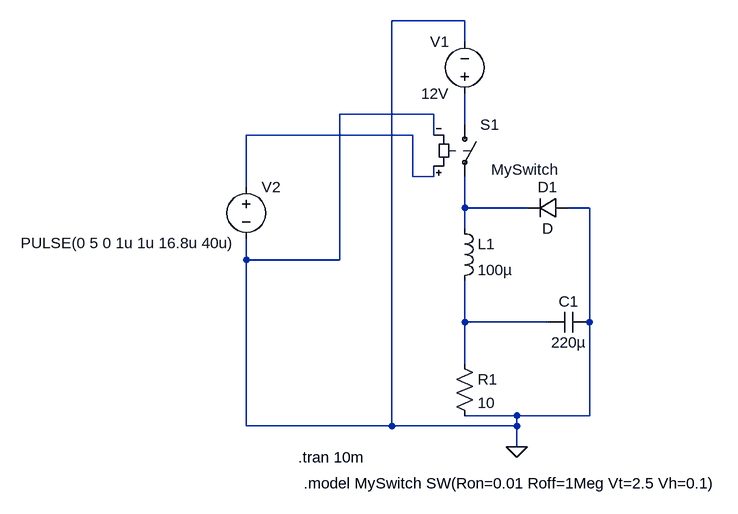
[diagram p0: schematic Buck_Converter.asc]
Buck_Converter.asc, the LTspice schematic file:
Version 4.1
SHEET 1 1072 744
WIRE 112 16 0 16
WIRE 112 48 112 16
WIRE 64 160 -80 160
WIRE 112 176 112 128
WIRE 32 192 -224 192
WIRE 64 192 64 160
WIRE 32 256 32 192
WIRE 64 256 64 240
WIRE 64 256 32 256
WIRE -224 272 -224 192
WIRE 112 304 112 256
WIRE 208 304 112 304
WIRE 304 304 272 304
WIRE 112 336 112 304
WIRE -224 384 -224 352
WIRE -80 384 -80 160
WIRE -80 384 -224 384
WIRE 112 480 112 416
WIRE 240 480 112 480
WIRE 304 480 304 304
WIRE 112 544 112 480
WIRE 192 624 112 624
WIRE 304 624 304 480
WIRE 304 624 192 624
WIRE -224 640 -224 384
WIRE 0 640 0 16
WIRE 0 640 -224 640
WIRE 192 640 192 624
WIRE 192 640 0 640
WIRE 192 672 192 640
FLAG 192 672 0
SYMBOL voltage 112 144 R180
WINDOW 0 24 96 Left 2
WINDOW 3 24 16 Left 2
WINDOW 123 0 0 Left 0
WINDOW 39 0 0 Left 0
SYMATTR InstName V1
SYMATTR Value 12V
SYMBOL diode 272 288 R90
WINDOW 0 0 32 VBottom 2
WINDOW 3 32 32 VTop 2
SYMATTR InstName D1
SYMBOL ind 96 320 R0
SYMATTR InstName L1
SYMATTR Value 100µ
SYMATTR SpiceLine Rser=1m
SYMBOL cap 304 464 R90
WINDOW 0 0 32 VBottom 2
WINDOW 3 32 32 VTop 2
SYMATTR InstName C1
SYMATTR Value 220µ
SYMBOL res 96 528 R0
SYMATTR InstName R1
SYMATTR Value 10
SYMBOL voltage -224 256 R0
WINDOW 123 0 0 Left 0
WINDOW 39 0 0 Left 0
WINDOW 3 -347 102 Left 2
SYMATTR InstName V2
SYMATTR Value PULSE(0 5 0 1u 1u 16.8u 40u)
SYMBOL sw 112 160 R0
WINDOW 3 41 85 Left 2
SYMATTR InstName S1
SYMATTR Value MySwitch
TEXT -144 688 Left 2 !.tran 10m
TEXT -136 728 Left 2 !.model MySwitch SW(Ron=0.01 Roff=1Meg Vt=2.5 Vh=0.1)

The netlist it stands for:
* Buck_Converter.asc
V1 N001 0 12V
D1 0 N003 D
L1 N003 N004 100µ Rser=1m
C1 0 N004 220µ
R1 N004 0 10
V2 N002 0 PULSE(0 5 0 1u 1u 16.8u 40u)
S1 N001 N003 N002 0 MySwitch
.model D D
.lib standard.dio
.tran 10m
.model MySwitch SW(Ron=0.01 Roff=1Meg Vt=2.5 Vh=0.1)
.backanno
.end